# Altium schematic sheet OTHER_PARTS.SchDoc
size A4; SheetNumber: 2; SheetTotal: 2
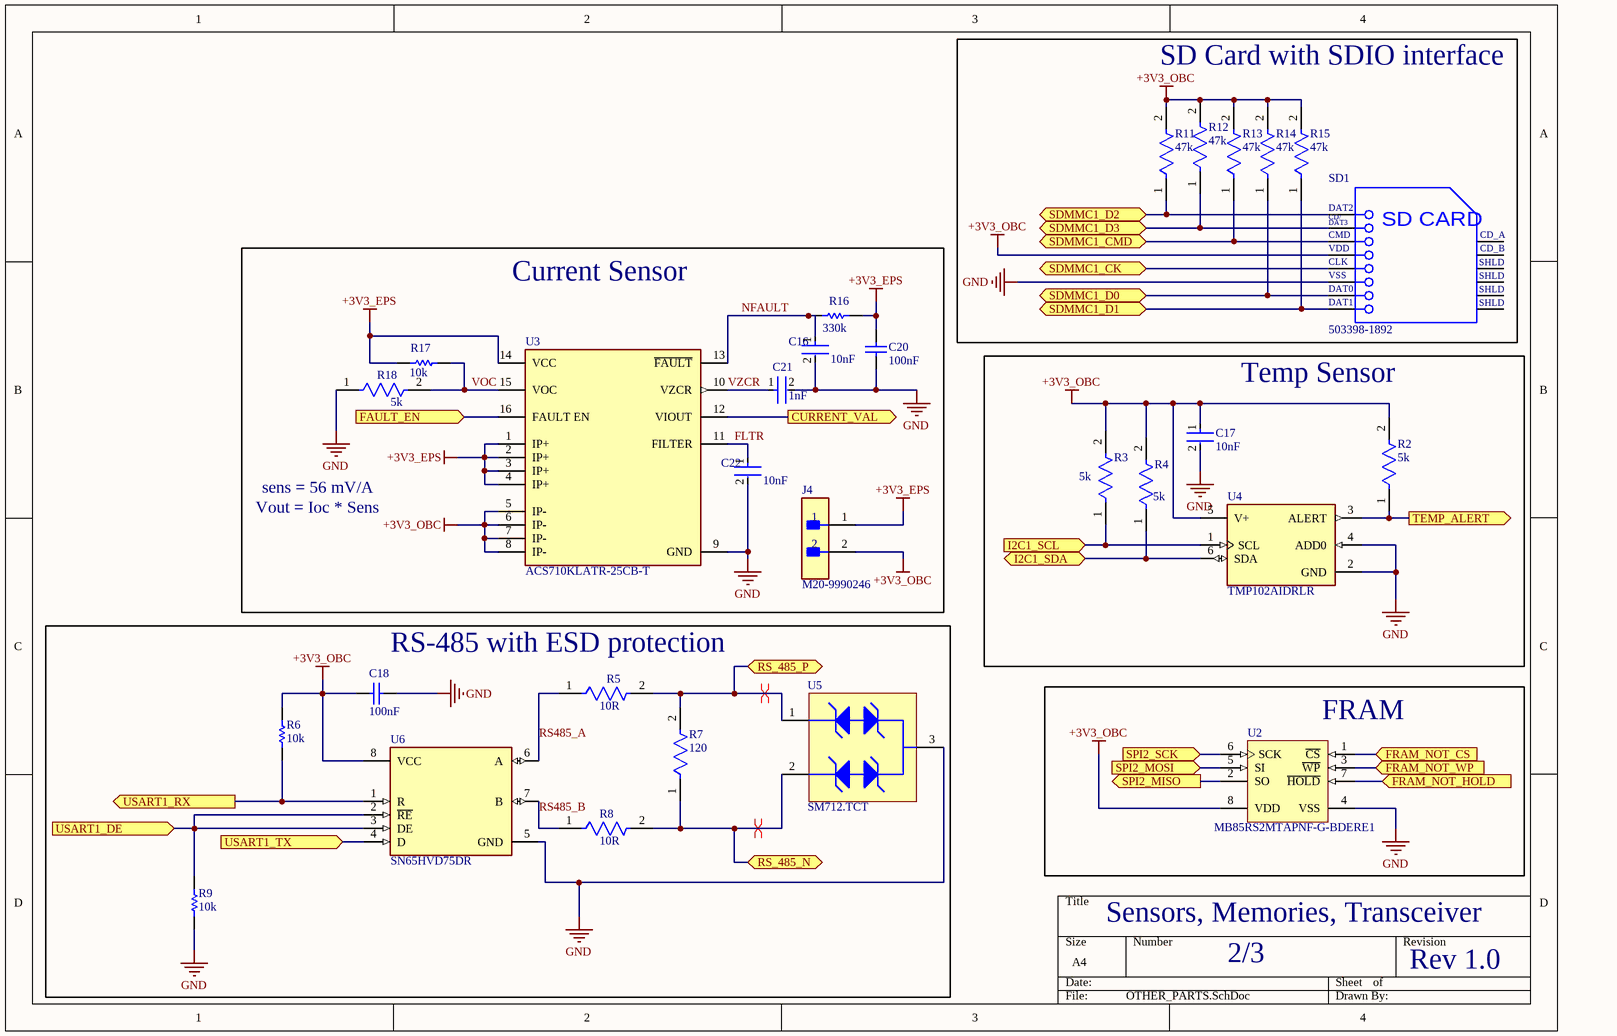
[diagram p0: OTHER_PARTS.SchDoc]

## Parts
C16  10nF  [FP-CL165-IPC_C]
C17  10nF  [FP-CL165-IPC_C]
C18  100nF  [SAMS-C0603-2_M]
C20  100nF  [SAMS-C0603-2_M]
C21  1nF  [FP-CC0402-MFG]
C22  10nF  [FP-CL165-IPC_C]
J4  M20-9990246  [FP-M20-9990246-MFG]
R2  5k  [FP-MCR01-MFG]
R3  5k  [FP-MCR01-MFG]
R4  5k  [FP-MCR01-MFG]
R5  10R  [FP-SR0805-MFG]
R6  10k  [RESC1608X55X25ML10T15]
R7  120  [FP-AC1206-MFG]
R8  10R  [FP-SR0805-MFG]
R9  10k  [RESC1608X55X25ML10T15]
R11  47k  [FP-MCR01-IPC_C]
R12  47k  [FP-MCR01-IPC_C]
R13  47k  [FP-MCR01-IPC_C]
R14  47k  [FP-MCR01-IPC_C]
R15  47k  [FP-MCR01-IPC_C]
R16  330k  [RESC1005X40X25ML05T10]
R17  10k  [RESC1608X55X25ML10T15]
R18  5k  [FP-MCR01-MFG]
SD1  503398-1892  [MOLX-503398-1892_V]
U2  MB85RS2MTAPNF-G-BDERE1  [CYP-S08.15_M]
U3  ACS710KLATR-25CB-T  [FP-LA-16-IPC_C]
U4  TMP102AIDRLR  [FP-DRL0006A-MFG]
U5  SM712.TCT  [SMTC-SOT23-3_V]
U6  SN65HVD75DR  [FP-D0008A-MFG]

## Blocks framed on the sheet
SD Card with SDIO interface: R11-R15 SD1
Current Sensor: C16 C20-C22 J4 R16-R18 U3
Temp Sensor: C17 R2-R4 U4
RS-485 with ESD protection: C18 R5-R9 U5 U6
FRAM: U2

## Ports
CURRENT_VAL (out), FAULT_EN (in), FRAM_NOT_CS (in), FRAM_NOT_HOLD (in), FRAM_NOT_WP (in), I2C1_SCL (in), I2C1_SDA (bidir), RS_485_N (bidir), RS_485_P (bidir), SDMMC1_CK (bidir), SDMMC1_CMD (bidir), SDMMC1_D0 (bidir), SDMMC1_D1 (bidir), SDMMC1_D2 (bidir), SDMMC1_D3 (bidir), SPI2_MISO (out), SPI2_MOSI (in), SPI2_SCK (in), TEMP_ALERT (out), USART1_DE (in), USART1_RX (out), USART1_TX (in)

## Nets
+3V3_EPS: C20.2 J4.1 R16.2 R17.2 U3.1(IP+) U3.2(IP+) U3.3(IP+) U3.4(IP+) U3.14(VCC)
+3V3_OBC: C17.1 C18.1 J4.2 R2.2 R3.2 R4.2 R6.2 R11.2 R12.2 R13.2 R14.2 R15.2 SD1.4(VDD) U2.8(VDD) U3.5(IP-) U3.6(IP-) U3.7(IP-) U3.8(IP-) U4.5(V+) U6.8(VCC)
GND: C16.2 C17.2 C18.2 C20.1 C21.2 C22.2 R9.1 R18.1 SD1.6(VSS) U2.4(VSS) U3.9(GND) U4.2(GND) U4.4(ADD0) U5.3 U6.5(GND)
CURRENT_VAL: U3.12(VIOUT) ; port CURRENT_VAL
FAULT_EN: U3.16(FAULT_EN) ; port FAULT_EN
FLTR: C22.1 U3.11(FILTER)
FRAM_NOT_CS: U2.1(~{CS}) ; port FRAM_NOT_CS
FRAM_NOT_HOLD: U2.7(~{HOLD}) ; port FRAM_NOT_HOLD
FRAM_NOT_WP: U2.3(~{WP}) ; port FRAM_NOT_WP
I2C1_SCL: R3.1 U4.1(SCL) ; port I2C1_SCL
I2C1_SDA: R4.1 U4.6(SDA) ; port I2C1_SDA
NFAULT: C16.1 R16.1 U3.13(~{FAULT})
RS485_A: R5.1 U6.6(A)
RS485_B: R8.1 U6.7(B)
RS_485_N: R7.1 R8.2 U5.2 ; port RS_485_N
RS_485_P: R5.2 R7.2 U5.1 ; port RS_485_P
SDMMC1_CK: SD1.5(CLK) ; port SDMMC1_CK
SDMMC1_CMD: R13.1 SD1.3(CMD) ; port SDMMC1_CMD
SDMMC1_D0: R14.1 SD1.7(DAT0) ; port SDMMC1_D0
SDMMC1_D1: R15.1 SD1.8(DAT1) ; port SDMMC1_D1
SDMMC1_D2: R11.1 SD1.1(DAT2) ; port SDMMC1_D2
SDMMC1_D3: R12.1 SD1.2(CD/DAT3) ; port SDMMC1_D3
SPI2_MISO: U2.2(SO) ; port SPI2_MISO
SPI2_MOSI: U2.5(SI) ; port SPI2_MOSI
SPI2_SCK: U2.6(SCK) ; port SPI2_SCK
TEMP_ALERT: R2.1 U4.3(ALERT) ; port TEMP_ALERT
USART1_DE: R9.2 U6.2(~{RE}) U6.3(DE) ; port USART1_DE
USART1_RX: R6.1 U6.1(R) ; port USART1_RX
USART1_TX: U6.4(D) ; port USART1_TX
VOC: R17.1 R18.2 U3.15(VOC)
VZCR: C21.1 U3.10(VZCR)

Not connected (* = marked no-connect by the designer): SD1 9(CD_A) 10(CD_B) 11(SHLD) 12(SHLD) 13(SHLD) 14(SHLD)

## Layout directives
differential pair: RS_485_N, RS_485_P

## Notes on the sheet
- Vout = Ioc * Sens
- sens = 56 mV/A
- Sensors, Memories, Transceiver
- 2/3
- Rev 1.0
- (in symbol CMP-2000-05621-1) CD/; DAT3; SD CARD

## Library data of the parts
C16 C17 C22 = CMP-13271-000387-1: Cap Ceramic 10nF 50V X7R ±10% SMD 0402 +125°C Paper T/R; Depth: 0.5mm; Length: 1mm; Lead Free: Lead Free; Case Code (Metric): 1005; Width: 0.02inch; Min Operating Temperature: -55°C; Thickness: 0.022inch; Package Quantity: 1; Mount: Surface Mount; Height: 0.5mm; Voltage: 50V; Material: Ceramic; Tolerance: 10%; Case Code (Imperial): 0402; Radiation Hardening: No; Case/Package: 0402; Max Operating Temperature: 125°C; Voltage Rating (DC): 50V; Contact Plating: Tin; Packaging: Tape and Reel; Voltage Rating: 50V; Capacitance: 10nF; Dielectric: X7R
C18 C20 = CMP-2000-05332-1: Multi-layer Ceramic Capacitor, -55 to 125 degC, 2-Pin SMD (0603), RoHS, Tape and Reel; Manufacturer: Samsung Electro-Mechanics; Capacitance: 0.1µF; Rated Voltage: 50V; Dielectric: X7R; Tolerance (%): ±10%; Case Size/Dimension: 0603; Datasheet URL: https://datasheet.ciiva.com/29198/456651-da-01-en-vs-kondensator-0605-29198839.pdf; Manufacturer URL: http://www.samsungsem.com/global/index.jsp; Datasheet Version: Nov-10
C21 = CMP-2002-03059-2: CAP CER 1000PF 50V X7R 0402; Manufacturer: YAGEO; Manufacturer Part Number: CC0402KRX7R9BB102; Value: 1.0 nF; Automotive Grade: NA; Tolerance: 0.1; Material: Ceramic; Temperature Coefficient: 30ppm/°C; Temperature Range High: +125°C; Device Class L3: Ceramic Capacitors; ComponentLink2Description: Datasheet; Footprint Url: http://www.yageo.com/exep/pages/download/literatures/UPY-C_GEN_24.pdf; ComponentLink2URL: http://www.yageo.com/documents/recent/UPY-GP_NP0_16V-to-50V_16.pdf; Mouser Description: 0402 1000 pF 50 V ±10 % Tolerance X7R SMT Multilayer Ceramic Capacitor; Ipc Land Pattern Name: CAPC10050X50; Temperature Range Low: -55°C; Digikey Description: CAP CER 1000PF 50V X7R 0402; Temperature Characteristic: X7R; Voltage Rating: 50 V; Lead Free: Yes; Device Class L1: Passive Components; Height: 0.55mm; Capacitance: 1.0 nF; Category: Cap; Device Class L2: Capacitors; Temperature: -55°C to +125°C; Package: CC0402; Octopart: https://octopart.com/cc0402krx7r9bb102-yageo-192889; Automotive: No; RoHS: TRUE
J4 = CMP-15831-000009-1: CONN HEADER VERT 2POS 2.54MM; Manufacturer: Harwin; Conn Gender: Male; Conn Orientation: Vertical; Number Of Contacts: 2; Current Rating: 3A; ComponentLink2URL: https://cdn.harwin.com/pdfs/M20-999.pdf; ComponentLink2Description: Datasheet; Package: M20-9990246; Temperature: -40°C to +105°C; Octopart: https://octopart.com/m20-9990246-harwin-2590635; Mouser Description: 2.54mm (0.1") Pitch SIL Vertical PC Tail Pin Header, 6.1mm mating pin height, tin, 2 contacts; Temperature Range High: +105°C; Device Class L1: Connectors; RoHS: TRUE; Automotive: No; Height: 8.99mm; Number Of Rows: 1; Contact Material: Tin,Nickel; Category: Conn; Pitch: 2.54mm; Lead Free: Yes; Digikey Description: CONN HEADER VERT 2POS 2.54MM; Manufacturer Part Number: M20-9990246; Temperature Range Low: -40°C; Device Class L3: unset; Device Class L2: Headers and Wire Housings
R2-R4 R18 = CMP-08839-006175-1: Thick Film Chip Resistor, 0402, 5.1kΩ, 1%, 100ppm/°C, 0.063W, 50V; Max Power Dissipation: 63mW; Resistance: 5.1kR; Temperature Coefficient: 400ppm/°C; Package Quantity: 10000; Length: 0.039inch; Number of Terminations: 2; Depth: 0.5mm; Case Code (Metric): 1005; Resistor Type: Thick Film; Series: MCR01; Width: 0.02inch; Construction: Rectangular; Case Code (Imperial): 0402; Case/Package: 0402; Voltage Rating (DC): 50V; Lead Free: Lead Free; RoHS Compliant: Yes; Packaging: Tape and Reel; Military Standard: Not; Height: 0.016inch; Max Operating Temperature: 155°C; Min Operating Temperature: -55°C; Tolerance: 1%; Features: Automotive AEC-Q200
R5 R8 = CMP-03412-003758-1: RES 10 OHM 1% 1/2W 0805; Manufacturer Part Number: SR0805FR-4710RL; Manufacturer: Yageo; Power Rating: 0.5W; Tolerance: 0.01; Value: 10Ω; Automotive Grade: Grade 0; Voltage Rating: 150V; ComponentLink2Description: Datasheet; RoHS: TRUE; Device Class L1: Passive Components; Footprint Url: http://www.yageo.com/exep/pages/download/literatures/PYu-R_Mount_10.pdf; Height: 0.6mm; Digikey Description: RES 10 OHM 1% 1/2W 0805; Temperature Range Low: -55°C; Mouser Description: Res Surge Chip Thick Film 0805 10 Ohm 1% 1/2W ±200ppm/°C Molded Paper T/R; Temperature Range High: +155°C; Octopart: https://octopart.com/sr0805fr-4710rl-yageo-91478096; Composition: Thick Film; Temperature: -55°C to +155°C; Ipc Land Pattern Name: RESC200125X50; Package: SR0805; Device Class L3: Chip SMD Resistors; Device Class L2: Resistors; Series: SR; ComponentLink2URL: http://www.yageo.com/documents/recent/PYu-SR_D_F%20tol_RoHS_L_3.pdf; Lead Free: Yes; Automotive: Yes; Category: Res; Resistance: 10Ω
R6 R9 R17 = CMP-2000-05022-1: Resistor, 10 KOhm, +/- 5%, 100 mW, -55 to 155 degC, 0603 (1608 Metric), RoHS, Tape and Reel; Manufacturer: Yageo; Resistance: 10kOhms; Voltage Rating: 50V; Temperature Coefficient: 100PPM/C; Power Rating: 100mW; Package Reference: 603; Series: RC; Case Code - mm: 1608; Packaging: Reel; Datasheet URL: http://www.farnell.com/datasheets/443971.pdf; Datasheet Version: Rev. 4, 04/2009; Operating Temperature Range: -55Cto+155C; Product: ThickFilmResistorsGeneralPurpose; Package Description: 2-Pin Surface Mount Device, Body 1.6 x 0.8 mm; Manufacturer URL: http://www.yageo.com/; Case Code - in: 0603; Tolerance: 5%; Termination Style: SMD/SMT
R7 = CMP-03412-006306-1: RES SMD 120 OHM 1% 1/4W 1206; Manufacturer: Yageo; Manufacturer Part Number: AC1206FR-07120RL; Value: 120Ω; Automotive Grade: Grade 0; Voltage Rating: 200V; Power Rating: 0.25W; Tolerance: 0.01; Lead Free: Yes; Ipc Land Pattern Name: RESC310160X55; Resistance: 120Ω; RoHS: TRUE; Digikey Description: RES SMD 120 OHM 1% 1/4W 1206; Footprint Url: http://www.yageo.com/exep/pages/download/literatures/PYu-R_Mount_10.pdf; Temperature: -55°C to +155°C; Octopart: https://octopart.com/ac1206fr-07120rl-yageo-30511031; Device Class L3: Chip SMD Resistors; ComponentLink2Description: Datasheet; Device Class L1: Passive Components; Temperature Range High: +155°C; Category: Res; Temperature Range Low: -55°C; Automotive: Yes; Series: AC; Package: AC1206; ComponentLink2URL: http://www.yageo.com/NewPortal/yageodocoutput?fileName=/pdf/R-Chip/PYu-AC_51_RoHS_L_6.pdf; Mouser Description: Thick Film Resistors - SMD 1/4W 120ohm 1% AEC-Q200; Composition: Thick Film; Height: 0.65mm; Device Class L2: Resistors
R11-R15 = CMP-08839-009136-1: Thick Film Chip Resistor, 0402, 47kΩ, 1%, 100ppm/°C, 0.063W, 50V; Resistance: 47kR; Temperature Coefficient: 400ppm/°C; Power Rating: 63mW; Depth: 0.5mm; Construction: Rectangular; Width: 0.02inch; Package Quantity: 1; Length: 0.039inch; Tolerance: 1%; Number of Terminations: 2; Case Code (Imperial): 0402; Packaging: Tape and Reel; Min Operating Temperature: -55°C; Mount: Surface Mount; RoHS Compliant: Yes; Max Operating Temperature: 155°C; Series: MCR01; Voltage Rating (DC): 50V; Size Code: 0402; Lead Free: Lead Free; Resistor Type: Thick Film; Case/Package: 0402; Features: Automotive AEC-Q200; Case Code (Metric): 1005; Military Standard: Not; Max Power Dissipation: 63mW; Height: 0.016inch
R16 = CMP-2002-07612-1: Manufacturer: Yageo / Phycomp; Part Number: RC0402FR-07330KL
SD1 = CMP-2000-05621-1: Micro SD Connector, Pitch 1.1 mm, 8 Position, Height 1.4 mm, -25 to 85 degC, RoHS, Tape and Reel; Manufacturer: Molex; Voltage Rating: 10VAC/DC; Current Rating: 500mA; Manufacturer URL: http://www.molex.com/; Package Reference: 503398-1892; Packaging: Reel; RoHS: Details; Brand: Molex; Datasheet URL: http://www.molex.com/pdm_docs/sd/5033981892_sd.pdf; Mounting Technology: SurfaceMount; Factory Pack Quantity: 2400; Datasheet Version: Rev. E, 04/2006; Series: 503398; Product Category: MemoryCardConnectors; Package Description: Micro SD Connector, Pitch 1.1 mm, 8 Position, Height 1.4 mm
U2 = CMP-1640-00001-1: 1-Mbit Serial F-RAM, 2 to 3.6 V, -40 to 85 degC, 8-Pin SOIC (S08.15), RoHS, Tube; Generic Part Number: FM25V10; PartNumber: FM25V10-G; Supply Voltage Min: 2 V; Memory Size: 1 Mbits; Access Time: 18 ns; Supply Voltage Max: 3.6 V; Temperature Min: -40 degC; Temperature Max: 85 degC; ComponentLink3Description: Package Specification; Code_JEDEC: MS-012; ComponentLink1Description: Manufacturer URL; RoHS: TRUE; ComponentLink3URL: http://www.mill-max.com/assets/pdfs/metric/007M.PDF; ComponentLink1URL: http://www.cypress.com/; PackageDescription: 8-Pin SOIC, Body 4.9 x 3.9 mm, Pitch 1.27 mm; ComponentLink2URL: http://www.cypress.com/file/41691/download; PackageVersion: Rev. *D, 12/2009; ComponentLink2Description: Datasheet; Mounting Technology: Surface Mount; Packing: Tube; DatasheetVersion: Rev. *F
U3 = CMP-82923-000225-1: SENSOR CURRENT HALL 25A AC/DC; Accuracy: 2.9%; Linearity: 0.75%; Max Supply Current: 14.5mA; Frequency: 120kHz; Sensitivity: 28mV/A; Max Supply Voltage: 5.5V; Polarity: Bidirectional; Min Supply Voltage: 3V; Quiescent Current: 11mA; Output Type: Analog; Response Time: 4us; Number of Channels: 1; Case/Package: SOIC; Mount: Surface Mount; Number of Pins: 16; Current Sensing: 25A; Packaging: Cut Tape; Series: -; RoHS Compliant: Yes; Bandwidth: 120kHz; REACH SVHC: No SVHC; Package Quantity: 1; Max Operating Temperature: 125°C; Min Operating Temperature: -40°C
U4 = CMP-04948-000029-1: SENSOR DIGITAL -40C-125C SOT563; Number of Bits: 12; Output Current: 3mA; Max Supply Voltage: 3.6V; Min Supply Voltage: 1.4V; Nominal Supply Current: 85uA; Operating Supply Current: 1uA; Resolution: 12b; Interface: I2C; Quiescent Current: 10uA; Lead Free: Lead Free; RoHS Compliant: Yes; Package Quantity: 4000; Weight: 9.9E-05oz; Series: -; Output Type: Digital; Radiation Hardening: No; Max Operating Temperature: 125°C; Case/Package: SOT-563; REACH SVHC: No SVHC; Number of Pins: 6; Supply Current: 85uA; Max Supply Voltage (DC): 3.6V; Min Supply Voltage (DC): 1.4V; Mount: Surface Mount; Min Operating Temperature: -40°C; Packaging: Tape and Reel
U5 = CMP-2000-05357-1: Asymmetrical TVS Diode for Extended Common-Mode RS-485, 400 W, -55 to 125 degC, 3-Pin SOT23, RoHS, Tape and Reel; Manufacturer: Semtech; Configuration: Dual; Peak Pulse Power Dissipation: 400W; Product Length (mm): 2.9mm; Working Voltage: 12V/7V; Product Height (mm): 0.95mm; Direction Type: Bi-Directional; Product Depth (mm): 1.3mm; Reverse Breakdown Voltage: 13.3V; Reverse Stand-off Voltage: 12V; Leakage Current (Max): 0.02uA; Number of Elements: 2; Peak Pulse Current: 17A; Leakage Current: 1uA/20uA; Rad Hardened: No; Test Current (It): 1mA; Clamping Voltage: 26V/12V; Datasheet URL: https://datasheet.ciiva.com/18065/getdatasheetpartid-110620-18065348.pdf; Operating Temperature Classification: Military; Operating Temperature Min Deg. C: -55C; Manufacturer URL: http://www.semtech.com/; Package Reference: SOT23-3; Operating Temp Range: -55Cto125C; Mounting Style: SurfaceMount; Polarity: Bi-Directional; Pin Count: 3; Package Description: 3-Pin Small Outline Transistor, Body 2.9 x 1.3 mm, Pitch 0.95 mm; Datasheet Version: Nov-04; Mounting: SurfaceMount; Suppressor Type: TVS; Packaging: TapeandReel; Package / Case: SOT-23; Operating Temperature Max Deg. C: 125C
U6 = CMP-0694-00003-3: IC TRANSCEIVER HALF 1/1 8SOIC; Max Supply Voltage: 3.6V; Number of Receivers: 1; Data Rate: 20Mbps; Operating Supply Voltage: 3.3V; Simplex/Duplex: Half Duplex; Receiver Hysteresis: 80mV; Interface: RS-422; Supply Current: 950uA; Min Supply Voltage: 3V; Lead Free: Lead Free; Max Operating Temperature: 125°C; Min Operating Temperature: -40°C; Packaging: Tape and Reel; REACH SVHC: No SVHC; Number of Transmitters: 1; Logic Function: Transceiver; Radiation Hardening: No; RoHS Compliant: Yes; Number of Drivers: 1; Contact Plating: Gold; Series: -; Number of Transceivers: 1; Case/Package: D; Package Quantity: 2500; Number of Pins: 8; Nominal Supply Current: 950uA